# Altium schematic sheet Magnetic Sensor.SchDoc
size A4; Organization: Altium Limited; Address1: L3, 12a Rodborough Rd; Address2: Frenchs Forest; Address3: NSW; Address4: Australia 2086
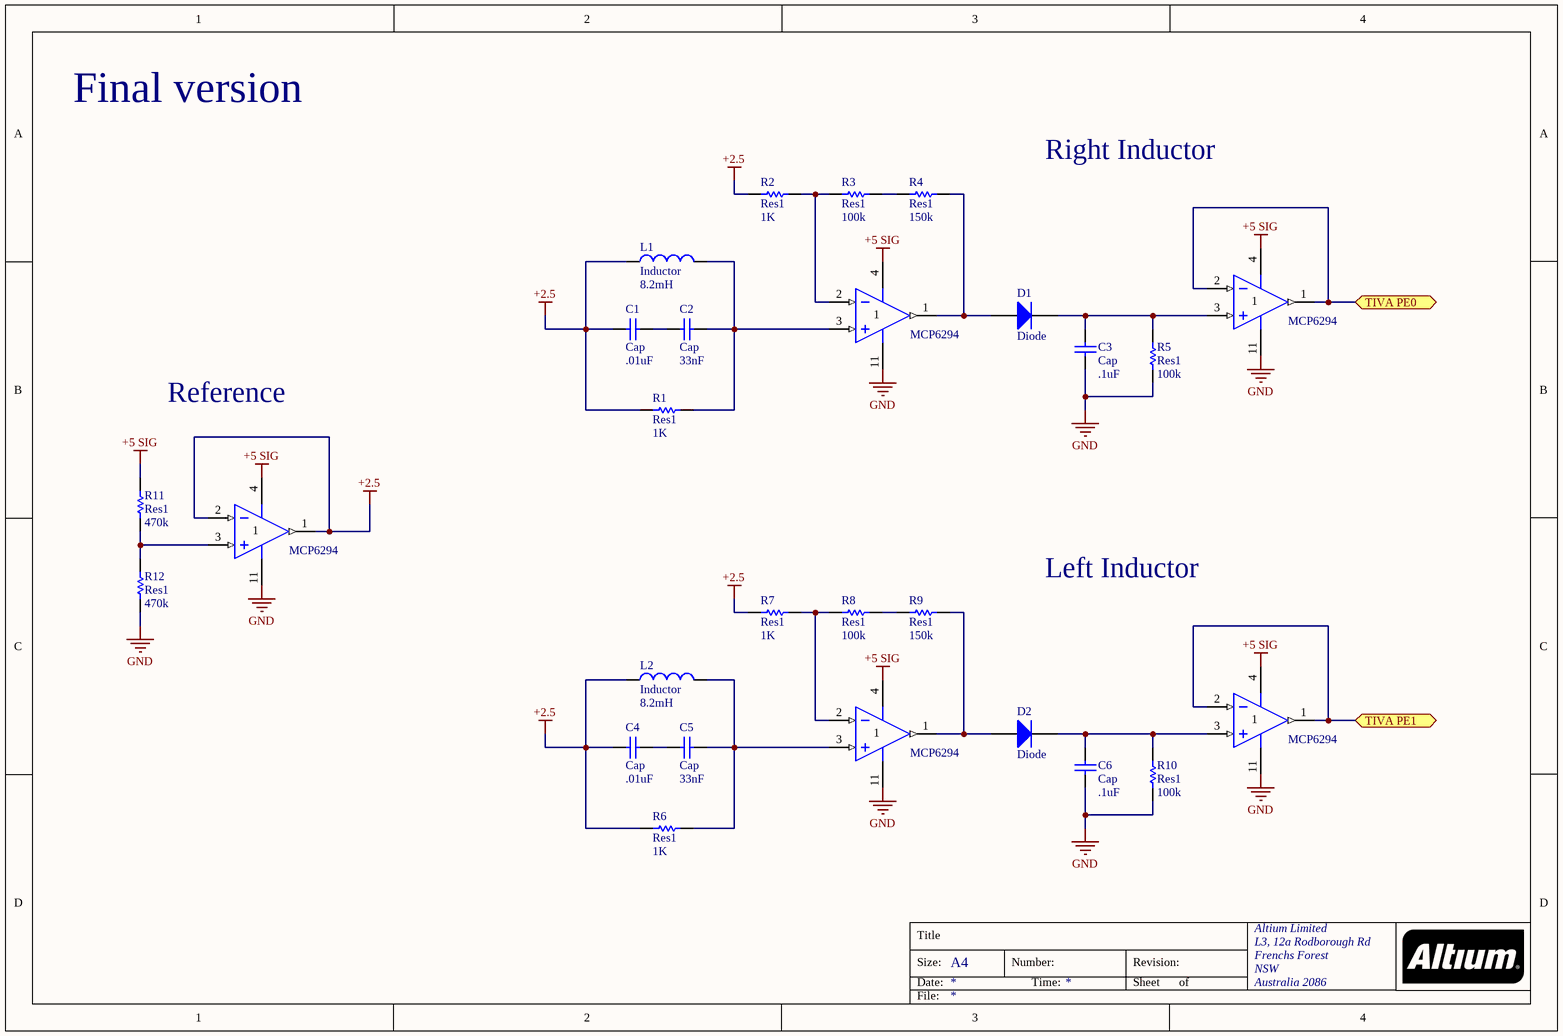
[diagram p0: Magnetic Sensor.SchDoc]

## Parts
C1  Cap  value .01uF  [RAD-0.3]
C2  Cap  value 33nF  [RAD-0.3]
C3  Cap  value .1uF  [RAD-0.3]
C4  Cap  value .01uF  [RAD-0.3]
C5  Cap  value 33nF  [RAD-0.3]
C6  Cap  value .1uF  [RAD-0.3]
D1  Diode  [DSO-C2/X3.3]
D2  Diode  [DSO-C2/X3.3]
L1  Inductor  value 8.2mH  [C1005-0402]
L2  Inductor  value 8.2mH  [C1005-0402]
R1  Res1  value 1K  [AXIAL-0.3]
R2  Res1  value 1K  [AXIAL-0.3]
R3  Res1  value 100k  [AXIAL-0.3]
R4  Res1  value 150k  [AXIAL-0.3]
R5  Res1  value 100k  [AXIAL-0.3]
R6  Res1  value 1K  [AXIAL-0.3]
R7  Res1  value 1K  [AXIAL-0.3]
R8  Res1  value 100k  [AXIAL-0.3]
R9  Res1  value 150k  [AXIAL-0.3]
R10  Res1  value 100k  [AXIAL-0.3]
R11  Res1  value 470k  [AXIAL-0.3]
R12  Res1  value 470k  [AXIAL-0.3]
U1  MCP6294  [DIP-14/D19.7]  (part A of 4)
U2  MCP6294  [DIP-14/D19.7]  (part A of 4)
U3  MCP6294  [DIP-14/D19.7]  (part A of 4)
U4  MCP6294  [DIP-14/D19.7]  (part A of 4)
U5  MCP6294  [DIP-14/D19.7]  (part A of 4)

## Ports
TIVA PE0, TIVA PE1

## Nets
+2.5: C1.1 C4.1 L1.1 L2.1 R1.1 R2.1 R6.1 R7.1 U5.1(OUT) U5.2(IN-)
+5 SIG: R11.2 U1.4(V+) U2.4(V+) U3.4(V+) U4.4(V+) U5.4(V+)
GND: C3.1 C6.1 R5.1 R10.1 R12.1 U1.11(V-) U2.11(V-) U3.11(V-) U4.11(V-) U5.11(V-)
TIVA PE0: U2.1(OUT) U2.2(IN-) ; port TIVA PE0
TIVA PE1: U4.1(OUT) U4.2(IN-) ; port TIVA PE1
NetC1_2: C1.2 C2.1
NetC2_2: C2.2 L1.2 R1.2 U1.3(IN+)
NetC3_2: C3.2 D1.2(K) R5.2 U2.3(IN+)
NetC4_2: C4.2 C5.1
NetC5_2: C5.2 L2.2 R6.2 U3.3(IN+)
NetC6_2: C6.2 D2.2(K) R10.2 U4.3(IN+)
NetD1_1: D1.1(A) R4.2 U1.1(OUT)
NetD2_1: D2.1(A) R9.2 U3.1(OUT)
NetR2_2: R2.2 R3.1 U1.2(IN-)
NetR3_2: R3.2 R4.1
NetR7_2: R7.2 R8.1 U3.2(IN-)
NetR8_2: R8.2 R9.1
NetR11_1: R11.1 R12.2 U5.3(IN+)

## Notes on the sheet
- Final version
- Right Inductor
- Reference
- Left Inductor
- Title
- Size:
- Date:
- A4
- Number:
- Time:
- Revision:
- Sheet
- of
- File:

## Library data of the parts
C1-C6 = Cap: Capacitor; Manufacturer: Generic Components; Class: Passive; Published: 08/06/2000; Publisher: Altium Hobart Technology Centre; SubClass: Capacitor
D1 D2 = Diode: Default Diode; Manufacturer: Generic Components; Class: Discrete; SubClass: Diode - Switching; Published: 08/06/2000; Publisher: Altium Hobart Technology Centre
L1 L2 = Inductor: Manufacturer: Generic Components; Class: Passive; Published: 08/06/2000; Publisher: Altium Hobart Technology Centre; SubClass: Inductor
R1-R12 = Res1: Resistor; Manufacturer: Generic Components; Class: Passive; Published: 08/06/2000; Publisher: Altium Hobart Technology Centre; SubClass: Resistor
U1-U5 = LM6144BIN: High-Speed/Low-Power 17MHz Rail-to-Rail, Input-Output Operational Amplifier; Manufacturer: National Semiconductor; Published: 15/04/2002; Publisher: Altium Hobart Technology Centre; Class: Amplifier; SubClass: Operational Amplifier